# EAGLE design Gas_Sensor (EAGLE 6.4)
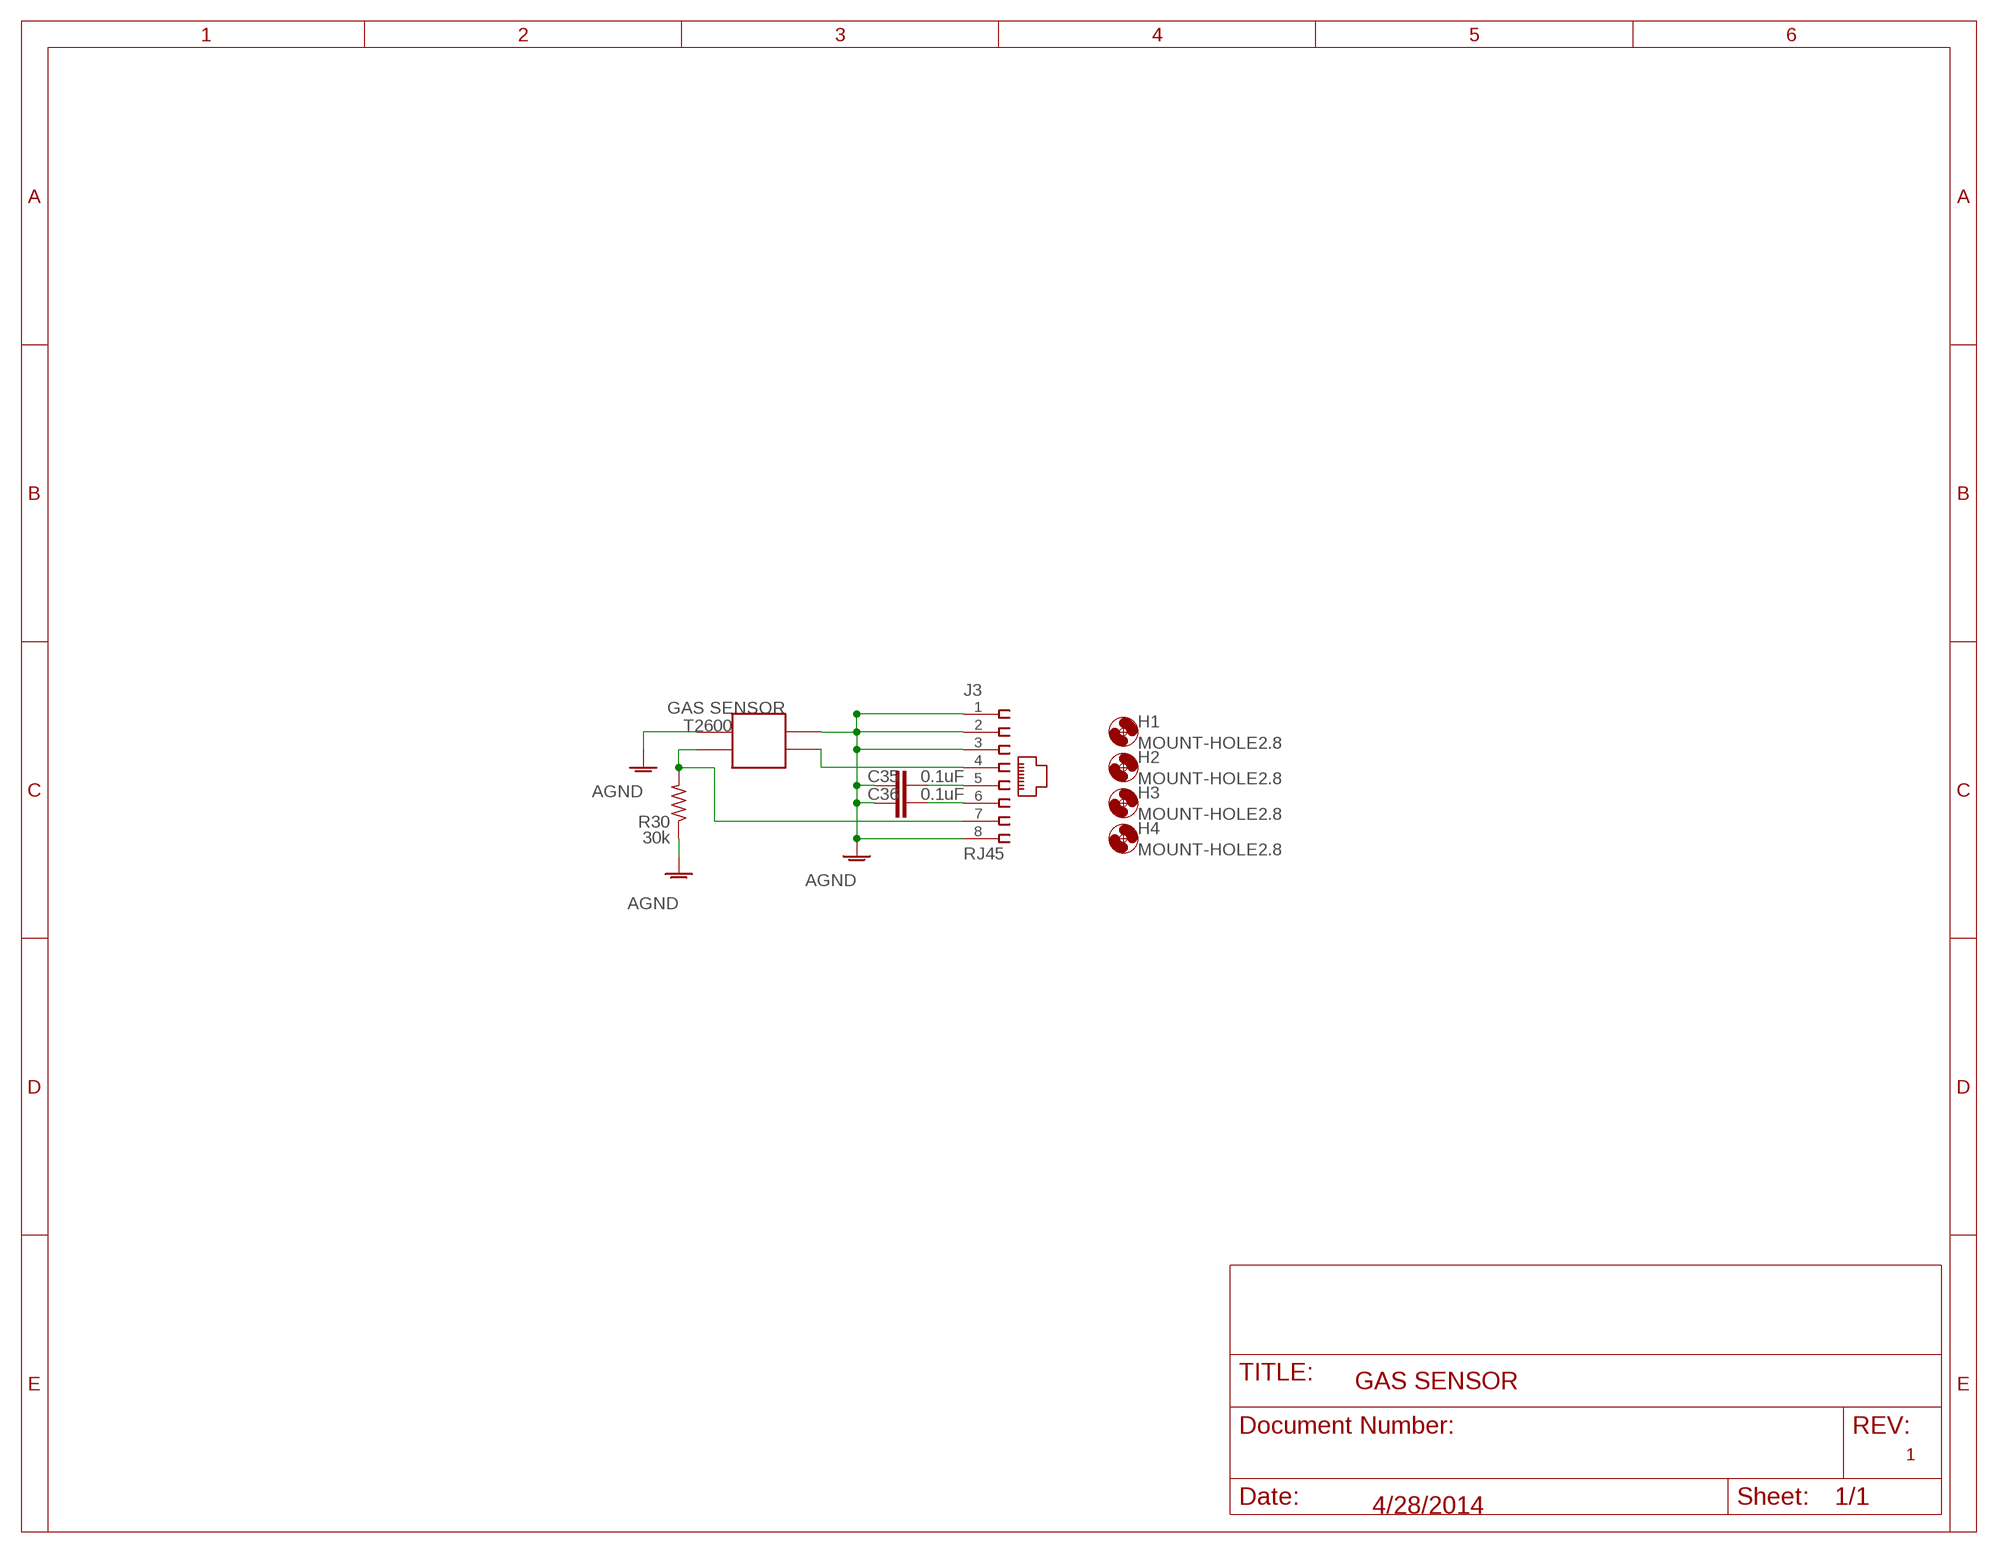
[diagram p0: schematic, sheet 1]

## Parts
C35  0.1uF  C-EUC0603K  [C0603K]
C36  0.1uF  C-EUC0603K  [C0603K]
H1  MOUNT-HOLE2.8  [2,8]
H2  MOUNT-HOLE2.8  [2,8]
H3  MOUNT-HOLE2.8  [2,8]
H4  MOUNT-HOLE2.8  [2,8]
J3  RJ45  555167-1  [555167-1]
R30  30k  R-US_R1206  [R1206]
X1  GAS_SENSOR  [GAS_SENSOR]

## Nets
AGND: C35.2 C36.2 J3.1 J3.2 J3.3 J3.8 R30.1 X1.P$1 X1.P$2
N$1: J3.4 X1.P$3
N$2: J3.7 R30.2 X1.P$4
N$24: C36.1 J3.6
N$25: C35.1 J3.5

## Notes on the sheet
- GAS SENSOR
- T2600
- GAS SENSOR
- 1
- 4/28/2014

## Library data of the parts
C35 C36 = rcl:C-EU: CAPACITOR, European symbol
H1-H4 = holes:MOUNT-HOLE: MOUNTING HOLE with drill center marker
J3 = con-amp:555167-1: AMP connector
R30 = rcl:R-US_: RESISTOR, American symbol
X1 = figaro:GAS_SENSOR

## Board
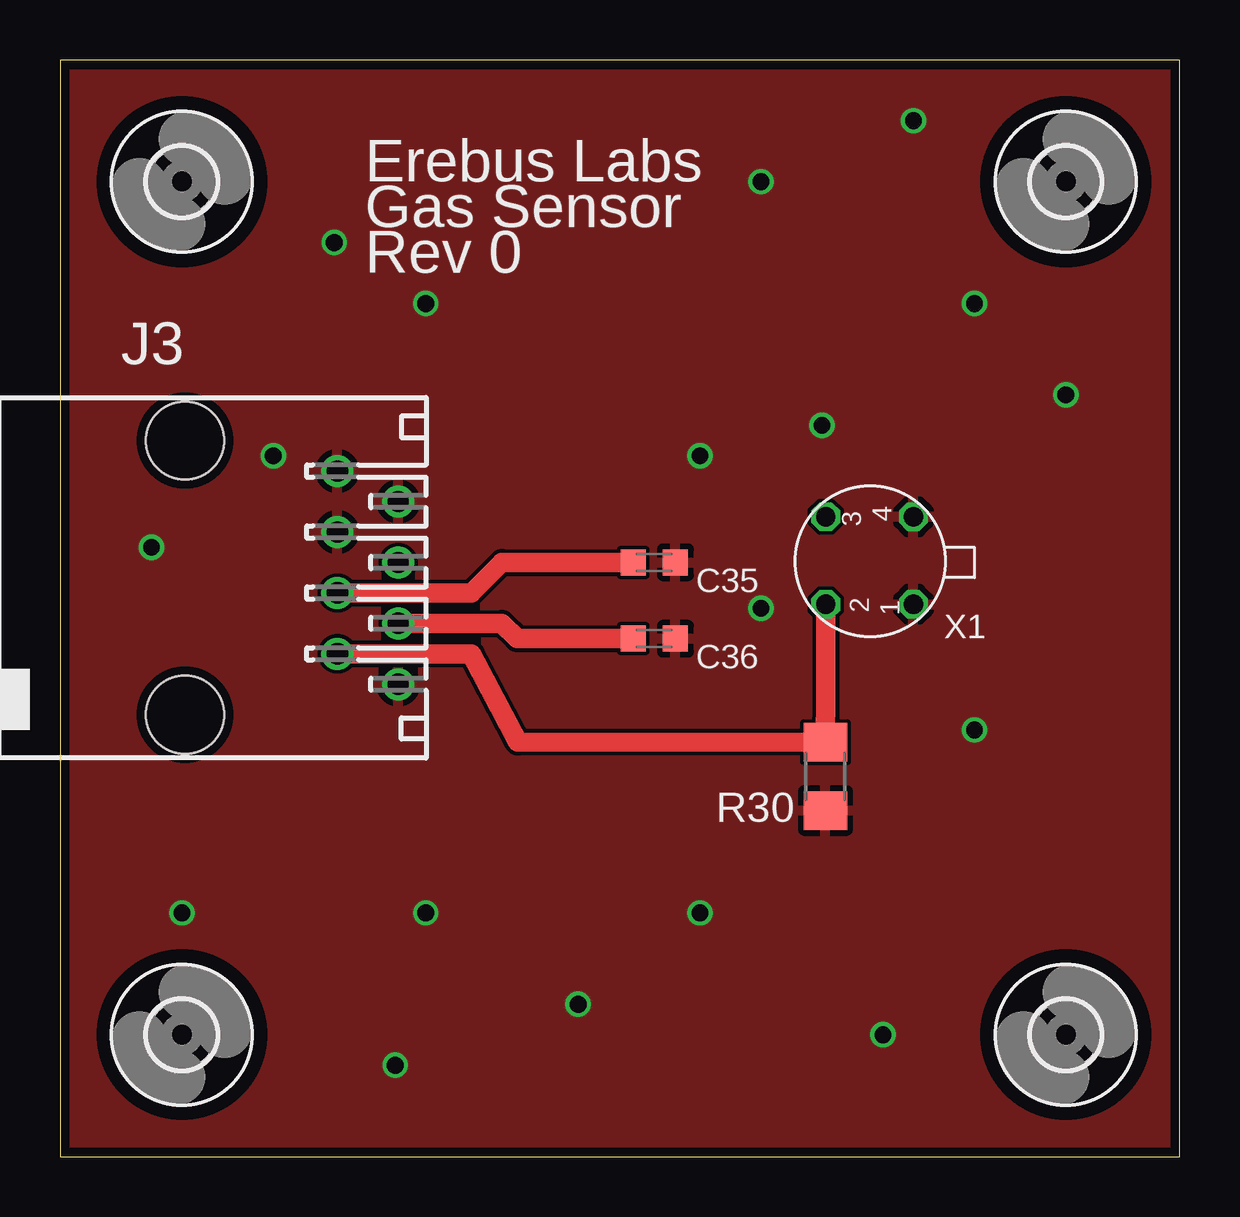
[diagram p1: board, top side]
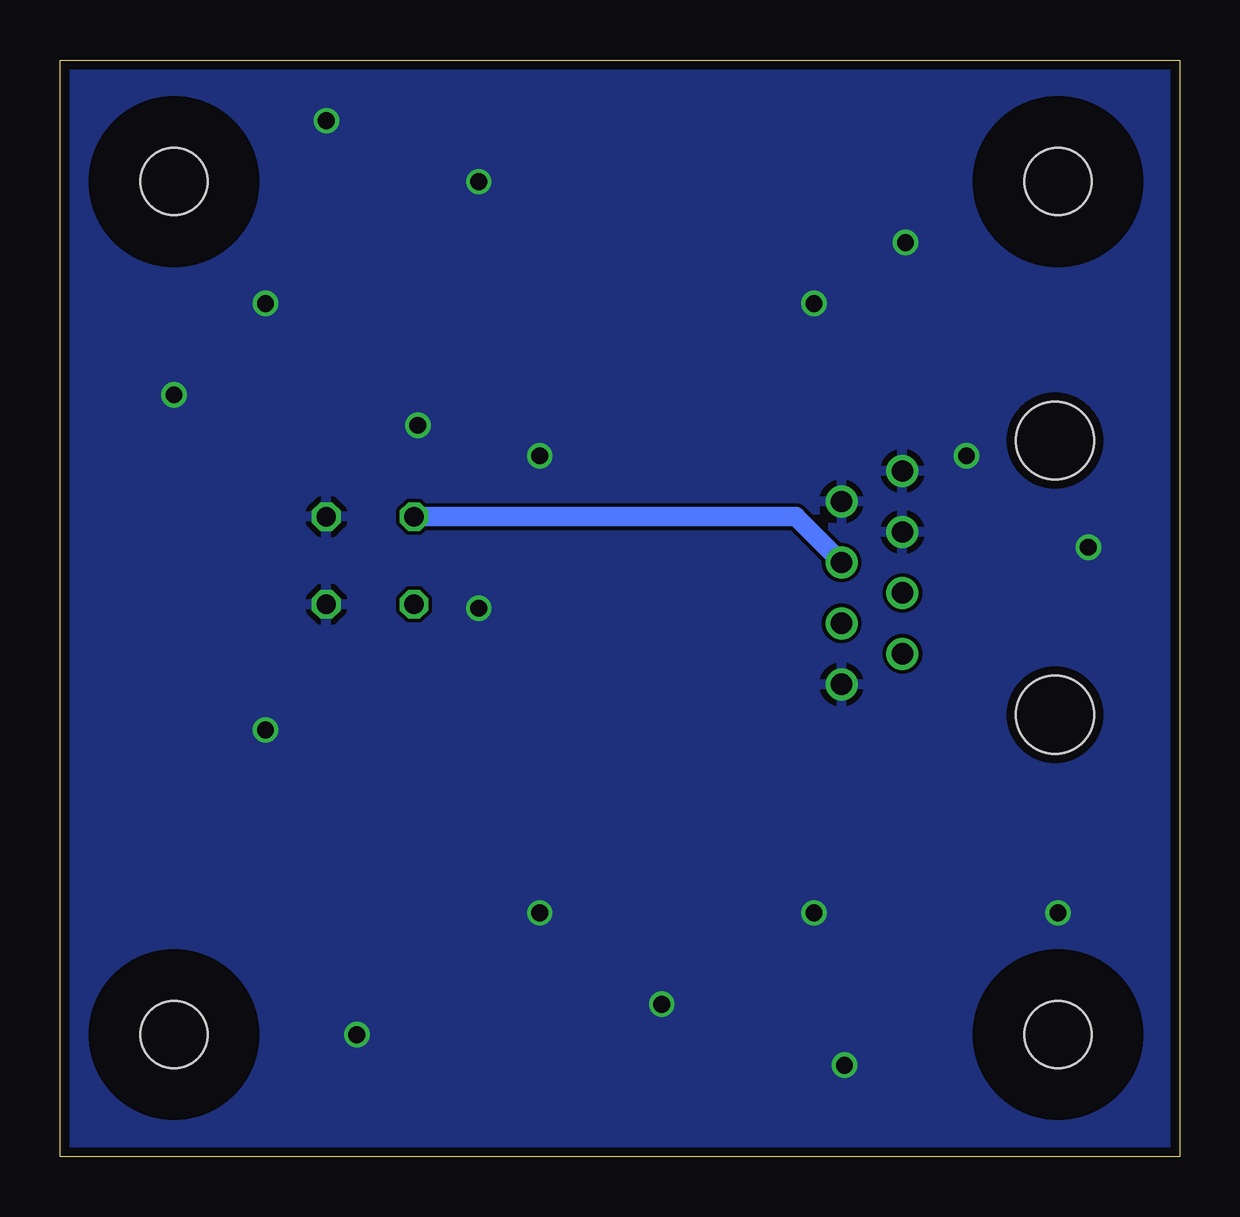
[diagram p2: board, bottom side, seen from below]

Size 46.66 x 45.71 mm. Coordinates in mm from the lower left corner, seen from the top.
Outline: 0,0 46.66,0 46.66,45.71 0,45.71 0,0
Copper layers (1*16): Top 0.0356mm / dielectric 1.5011mm / Bottom 0.0356mm
Design rules "LaenPCBOrder": minimum track width 6mil, minimum drill 13mil, track to track 6mil, track to pad 6mil, pad to pad 6mil, via to via 6mil, smd to smd 6mil, copper to edge 15mil, drill to drill 6mil, minimum pad ring 7mil, minimum via ring 7mil, stop-mask expansion 3mil, vias tented up to drill 0mil, thermal gap 10mil

### Footprints (pad centres in the part's own frame; a part is rotated, then mirrored left to right if it is on the bottom)
C0603K = smd 1.05 x 1.08: 1 -0.875,0; 2 0.875,0
2,8 = hole 2.8: 0,0
555167-1 = drill 0.889: 1 -4.445,5.207; 2 -3.175,7.747; 3 -1.905,5.207; 4 -0.635,7.747; 5 0.635,5.207; 6 1.905,7.747; 7 3.175,5.207; 8 4.445,7.747 | hole 3.251: -5.715,-1.143; 5.715,-1.143
R1206 = smd 1.6 x 1.803: 1 -1.422,0; 2 1.422,0
GAS_SENSOR = drill 0.8 octagon: P$1 0,0; P$2 3.65,0; P$3 0,-3.65; P$4 3.65,-3.65

### Placement (x,y rotation side)
C35  24.77,24.77 0 top
C36  24.77,21.59 0 top
H1  5.08,5.08 0 top
H2  5.08,40.64 0 top
H3  41.91,40.64 0 top
H4  41.91,5.08 0 top
J3  6.35,24.13 270 top
R30  31.89,15.84 90 top
X1  35.56,26.67 270 top

### Tracks (layer width: path | path; a pad name or v marks a point on that pad's centre or on a via)
AGND  (via drill 0.7 pad 0.41)
  other vias: 13.97,3.81 15.24,10.16 21.59,6.35 34.29,5.08 26.67,10.16 38.1,17.78 5.08,10.16 29.21,22.86 3.81,25.4 8.89,29.21 26.67,29.21 31.75,30.48 41.91,31.75 35.56,43.18 38.1,35.56 29.21,40.64 15.24,35.56 11.43,38.1
  pour Bottom: 0,45.72 46.99,45.72 46.99,0 0,0
  pour Top: 0,45.72 46.99,45.72 46.99,0 0,0
N$1
  Bottom 0.813: X1.P$3 16,26.67 J3.4
N$2
  Top 0.813: X1.P$4 31.91,19.36 R30.2 19.08,17.28 17.14,20.95 J3.7
N$24
  Top 0.813: J3.6 18.41,22.23 19.05,21.59 C36.1
N$25
  Top 0.813: J3.5 17.14,23.49 18.41,24.77 C35.1

### Text on the board
tPlace: Erebus Labs | Gas Sensor | Rev 0
tNames: X1